# EAGLE design dream_breakout (EAGLE 7.2.0)
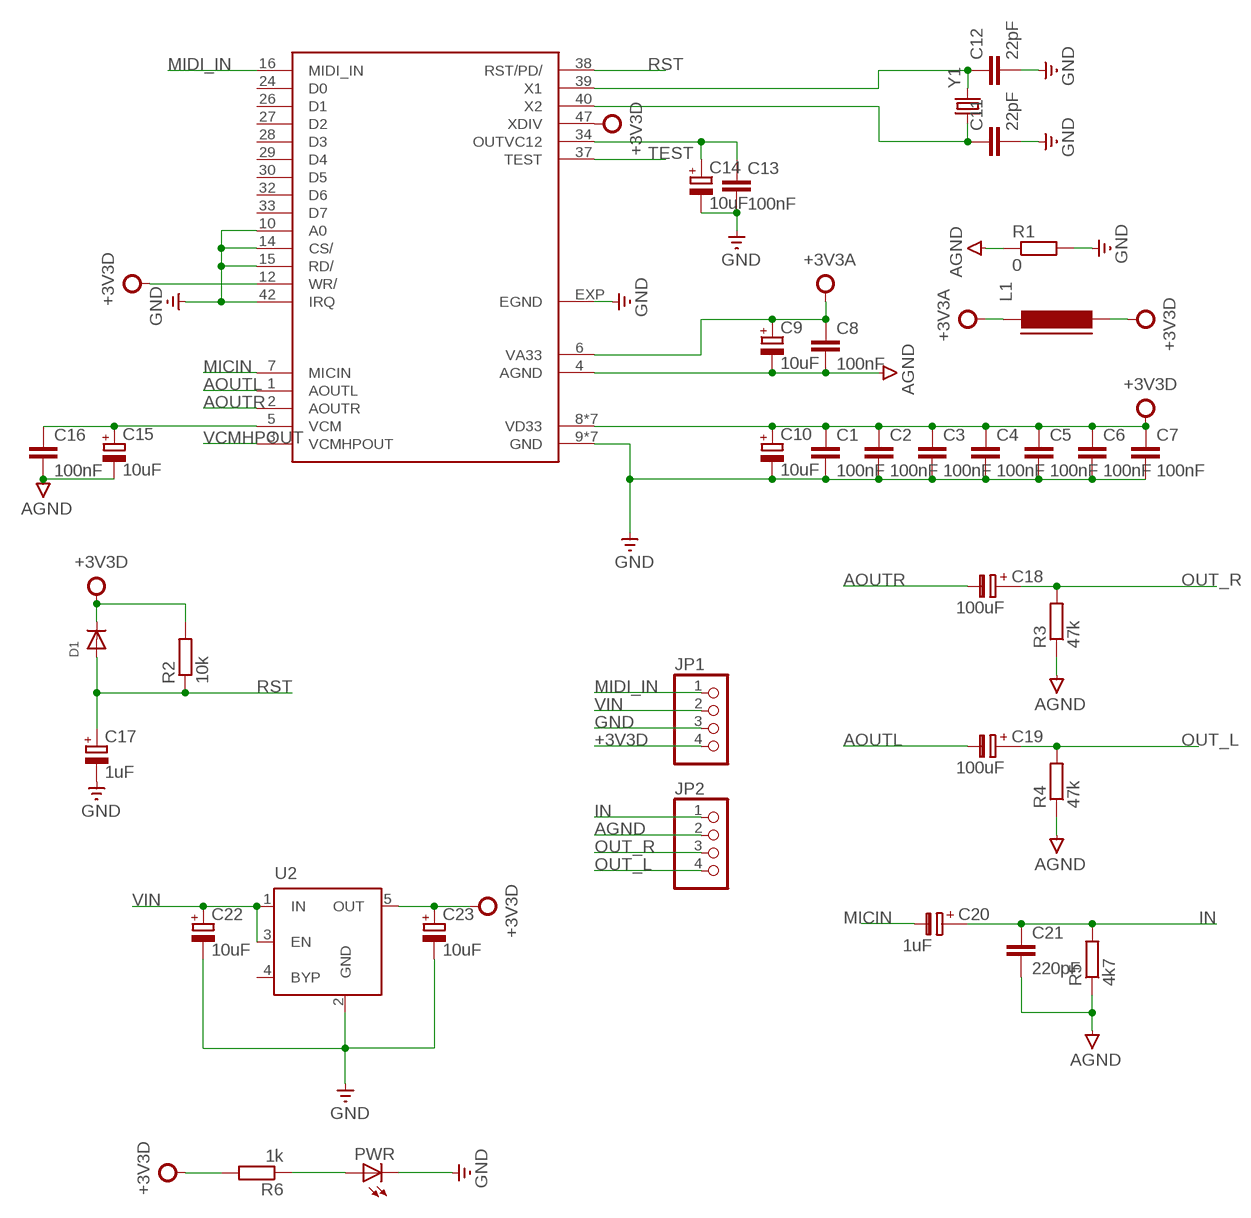
[diagram p0: schematic, sheet 1]

## Parts
C1  100nF  C-EUC0603K  [C0603K]
C2  100nF  C-EUC0603K  [C0603K]
C3  100nF  C-EUC0603K  [C0603K]
C4  100nF  C-EUC0603K  [C0603K]
C5  100nF  C-EUC0603K  [C0603K]
C6  100nF  C-EUC0603K  [C0603K]
C7  100nF  C-EUC0603K  [C0603K]
C8  100nF  C-EUC0603K  [C0603K]
C9  10uF  CPOL-EUA/3216-18R  [A/3216-18R]
C10  10uF  CPOL-EUA/3216-18R  [A/3216-18R]
C11  22pF  C-EUC0603K  [C0603K]
C12  22pF  C-EUC0603K  [C0603K]
C13  100nF  C-EUC0603K  [C0603K]
C14  10uF  CPOL-EUA/3216-18R  [A/3216-18R]
C15  10uF  CPOL-EUA/3216-18R  [A/3216-18R]
C16  100nF  C-EUC0603K  [C0603K]
C17  1uF  CPOL-EUA/3216-18R  [A/3216-18R]
C18  100uF  C-PR-SMD-SV-B  [SV-B]
C19  100uF  C-PR-SMD-SV-B  [SV-B]
C20  1uF  C-PR-SMD-SV-B  [SV-B]
C21  220pF  C-EUC0603K  [C0603K]
C22  10uF  CPOL-EUA/3216-18R  [A/3216-18R]
C23  10uF  CPOL-EUA/3216-18R  [A/3216-18R]
D1  DIODESOD-123  [SOD-123]
JP1  HEADER-1X4ROUND  [1X04_ROUND]
JP2  HEADER-1X4ROUND  [1X04_ROUND]
L1  FERRITE-0603  [FB603]
PWR  LEDCHIP-LED0603  [CHIP-LED0603]
R1  0  R-EU_R0603  [R0603]
R2  10k  R-EU_R0603  [R0603]
R3  47k  R-EU_R0603  [R0603]
R4  47k  R-EU_R0603  [R0603]
R5  4k7  R-EU_R0603  [R0603]
R6  1k  R-EU_R0603  [R0603]
U1  SAM2695  [QFN48]
U2  MIC5219XX  [SOT23-5]
Y1  CRYSTALTXC-7A  [CRYSTAL-TXC-7A]

## Nets
+3V3A [VCC]: C8.1 C9.+ L1.1 U1.6(VA33)
+3V3D [VCC]: C1.1 C2.1 C3.1 C4.1 C5.1 C6.1 C7.1 C10.+ C23.+ D1.C JP1.4 L1.2 R2.2 R6.2 U1.8(VD33) U1.11(VD33) U1.12(WR/) U1.20(VD33) U1.31(VD33) U1.35(VD33) U1.41(VD33) U1.46(VD33) U1.47(XDIV) U2.5(OUT)
AGND [GND]: C8.2 C9.- C15.- C16.2 C21.2 JP2.2 R1.1 R3.1 R4.1 R5.1 U1.4(AGND)
AOUTL: C19.- U1.1(AOUTL)
AOUTR: C18.- U1.2(AOUTR)
GND [GND]: C1.2 C2.2 C3.2 C4.2 C5.2 C6.2 C7.2 C10.- C11.2 C12.2 C13.2 C14.- C17.- C22.- C23.- JP1.3 PWR.C R1.2 U1.9(GND) U1.10(A0) U1.13(GND) U1.14(CS/) U1.15(RD/) U1.18(GND) U1.25(GND) U1.36(GND) U1.42(IRQ) U1.45(GND) U1.48(GND) U1.EXP(EGND) U2.2(GND)
IN: C20.+ C21.1 JP2.1 R5.2
MICIN: C20.- U1.7(MICIN)
MIDI_IN: JP1.1 U1.16(MIDI_IN)
N$2: C13.1 C14.+ U1.34(OUTVC12)
N$3: C12.1 U1.39(X1) Y1.P$2
N$4: C11.1 U1.40(X2) Y1.P$1
N$5: PWR.A R6.1
N$6: C15.+ C16.1 U1.5(VCM)
OUT_L: C19.+ JP2.4 R4.2
OUT_R: C18.+ JP2.3 R3.2
RST: C17.+ D1.A R2.1 U1.38(RST/PD/)
TEST: U1.37(TEST)
VCMHPOUT: U1.3(VCMHPOUT)
VIN [VBUS]: C22.+ JP1.2 U2.1(IN) U2.3(EN)
Unconnected: U1.24(D0) U1.26(D1) U1.27(D2) U1.28(D3) U1.29(D4) U1.30(D5) U1.32(D6) U1.33(D7) U2.4(BYP)

## Library data of the parts
C1-C8 C11-C13 C16 C21 = rcl:C-EU: CAPACITOR, European symbol
C9 C10 C14 C15 C17 C22 C23 = rcl:CPOL-EU: POLARIZED CAPACITOR, European symbol
C18-C20 = cap-pan40:C-PR: POLARIZED ELECTROLYTIC/TANTALUM
D1 = adafruit:DIODE: Diode SMADIODE - SMA Surface Mount Package 20V 1A Schottky Diode Digikey: 641-1014-6-ND DO-1N4148 - Through Hole Small Current Diode SOD-123 20V 1 A (.5mV Vf) Schottky Diode - Digikey: MBRX120TPMSCT-ND SOD-323 10V 570mA (.38mV Vf, 3ns) Schottky Diode - Digikey: ZLLS410CT-ND SOD-523 30V 30mA Schottky Diode (RB751S-40TE61) - Digikey: RB751S-40TE61CT-ND SOT23-R/W - SOT23 Package (R = Solder Paste/Reflow Ovens, W = Hand-Soldering) BAT54Film 40V 300mA - Digikey: 497-7162-1-ND
JP1 JP2 = microbuilder:HEADER-1X4: PIN HEADER
L1 = dp_devices:FERRITE: Ferrite bead in various packages
PWR = led:LED: LED OSRAM: - CHIPLED LG R971, LG N971, LY N971, LG Q971, LY Q971, LO R971, LY R971 LH N974, LH R974 LS Q976, LO Q976, LY Q976 LO Q996 - Hyper CHIPLED LW Q18S LB Q993, LB Q99A, LB R99A - SideLED LS A670, LO A670, LY A670, LG A670, LP A670 LB A673, LV A673, LT A673, LW A673 LH A674 LY A675 LS A676, LA A676, LO A676, LY A676, LW A676 LS A679, LY A679, LG A679 - Hyper Micro SIDELED® LS Y876, LA Y876, LO Y876, LY Y876 LT Y87S - SmartLED LW L88C, LW L88S LB L89C, LB L89S, LG L890 LS L89K, LO L89K, LY L89K LS L896, LA L896, LO L896, LY L896 - TOPLED LS T670, LO T670, LY T670, LG T670, LP T670 LSG T670, LSP T670, LSY T670, LOP T670, LYG T670 LG T671, LOG T671, LSG T671 LB T673, LV T673, LT T673, LW T673 LH T674 LS T676, LA T676, LO T676, LY T676, LB T676, LH T676, LSB T676, LW T676 LB T67C, LV T67C, LT T67C, LS T67K, LO T67K, LY T67K, LW E67C LS E67B, LA E67B, LO E67B, LY E67B, LB E67C, LV E67C, LT E67C LW T67C LS T679, LY T679, LG T679 LS T770, LO T770, LY T770, LG T770, LP T770 LB T773, LV T773, LT T773, LW T773 LH T774 LS E675, LA E675, LY E675, LS T675 LS T776, LA T776, LO T776, LY T776, LB T776 LHGB T686 LT T68C, LB T68C - Hyper Mini TOPLED® LB M676 - Mini TOPLED Santana® LG M470 LS M47K, LO M47K, LY M47K Source: http://www.osram.convergy.de LUXEON: - LUMILED® LXK2-PW12-R00, LXK2-PW12-S00, LXK2-PW14-U00, LXK2-PW14-V00 LXK2-PM12-R00, LXK2-PM12-S00, LXK2-PM14-U00 LXK2-PE12-Q00, LXK2-PE12-R00, LXK2-PE12-S00, LXK2-PE14-T00, LXK2-PE14-U00 LXK2-PB12-K00, LXK2-PB12-L00, LXK2-PB12-M00, LXK2-PB14-N00, LXK2-PB14-P00, LXK2-PB14-Q00 LXK2-PR12-L00, LXK2-PR12-M00, LXK2-PR14-Q00, LXK2-PR14-R00 LXK2-PD12-Q00, LXK2-PD12-R00, LXK2-PD12-S00 LXK2-PH12-R00, LXK2-PH12-S00 LXK2-PL12-P00, LXK2-PL12-Q00, LXK2-PL12-R00 Source: www.luxeon.com KINGBRIGHT: KA-3528ASYC Source: www.kingbright.com
R1-R6 = rcl:R-EU_: RESISTOR, European symbol
U1 = sam2695:SAM2695
U2 = v-reg-micrel:MIC5219XX: VOLTAGE REGULATOR; OC_FARNELL: unknown; OC_NEWARK: unknown
Y1 = SparkFun-FreqCtrl:CRYSTAL: Various standard crystals. Proven footprints. Spark Fun Electronics SKU : COM-00534

## Net classes
1 GND: width 0.305 mm
2 VCC: width 0.305 mm
3 VBUS: width 0.508 mm

## Board
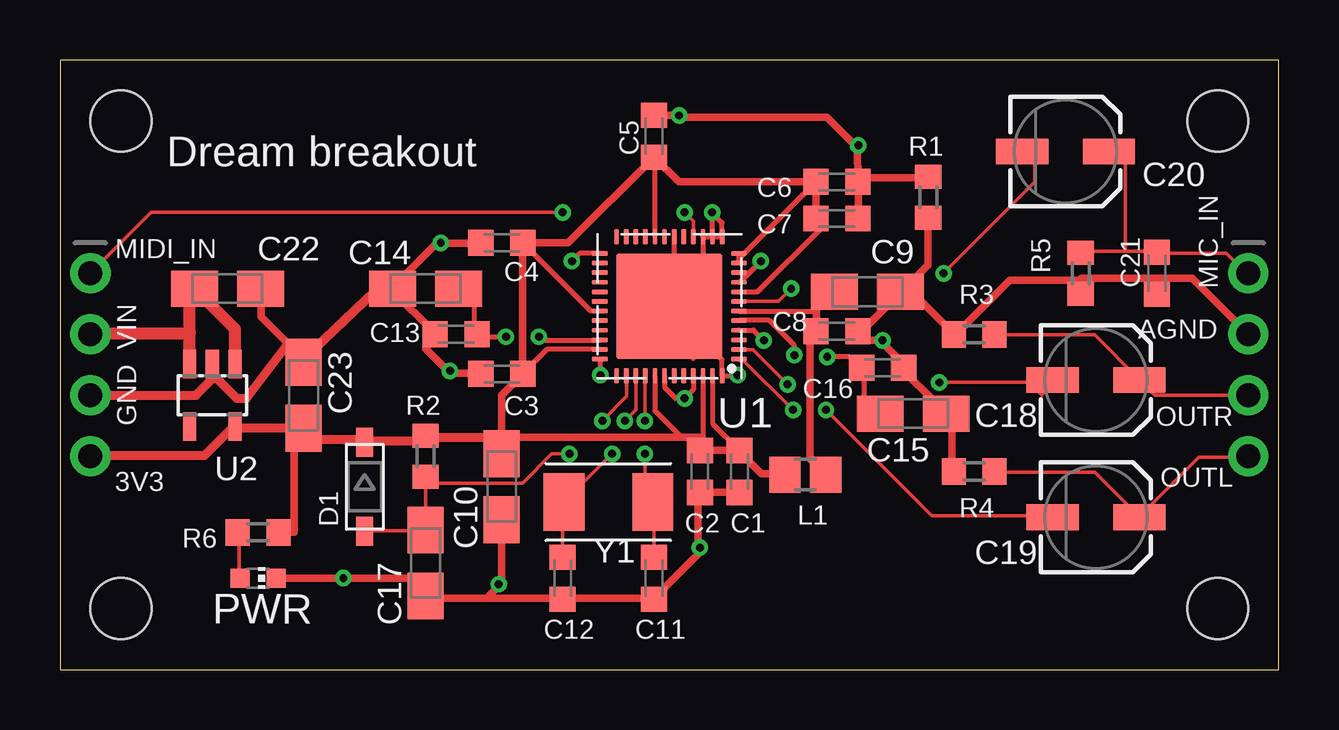
[diagram p1: board, top side]
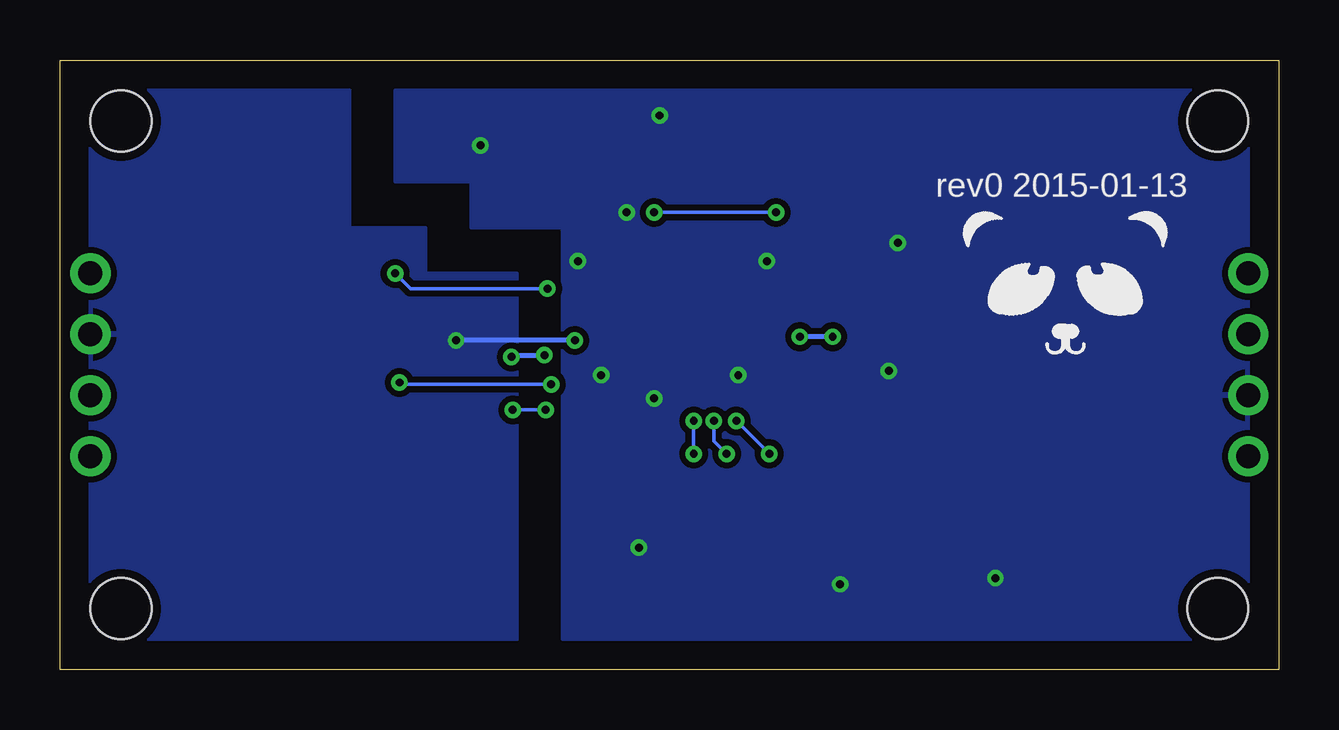
[diagram p2: board, bottom side, seen from below]

Size 50.8 x 25.4 mm. Coordinates in mm from the lower left corner, seen from the top.
Outline: 0,0 50.8,0 50.8,25.4 0,25.4 0,0
Copper layers (1*16): Top 0.0356mm / dielectric 1.5011mm / Bottom 0.0356mm
Design rules "oshpark-2layer": minimum track width 6mil, minimum drill 13mil, track to track 6mil, track to pad 6mil, pad to pad 6mil, via to via 6mil, smd to smd 6mil, copper to edge 15mil, drill to drill 6mil, minimum pad ring 7mil, minimum via ring 7mil, stop-mask expansion 4mil, vias tented up to drill 0mil, thermal gap 10mil
Holes 2.54 mm at 48.26,2.54 48.26,22.86 2.54,22.86 2.54,2.54

### Footprints (pad centres in the part's own frame; a part is rotated, then mirrored left to right if it is on the bottom)
C0603K = smd 1.05 x 1.08: 1 -0.875,0; 2 0.875,0
A/3216-18R = smd 1.95 x 1.5: + 1.375,0; - -1.375,0
SV-B = smd 2.184 x 1.067: + -1.81,0; - 1.81,0
SOD-123 = smd 1.2 x 0.7: A 1.85,0; C -1.85,0
1X04_ROUND = drill 1 pad 1.676: 1 -3.81,0; 2 -1.27,0; 3 1.27,0; 4 3.81,0
FB603 = smd 1.3 x 1.5: 1 -0.85,0; 2 0.85,0
CHIP-LED0603 = smd 0.8 x 0.8: A 0,-0.75; C 0,0.75
R0603 = smd 1 x 1.1: 1 -0.85,0; 2 0.85,0
QFN48 = smd 0.65 x 0.2: 1 -2.9,2.3; 2 -2.9,1.9; 3 -2.9,1.5; 4 -2.9,1.1; 5 -2.9,0.7; 6 -2.9,0.3; 7 -2.9,-0.1; 8 -2.9,-0.5; 9 -2.9,-0.9; 10 -2.9,-1.3; 11 -2.9,-1.7; 12 -2.9,-2.1; 25 2.9,-2.1; 26 2.9,-1.7; 27 2.9,-1.3; 28 2.9,-0.9; 29 2.9,-0.5; 30 2.9,-0.1; 31 2.9,0.3; 32 2.9,0.7; 33 2.9,1.1; 34 2.9,1.5; 35 2.9,1.9; 36 2.9,2.3 | smd 0.2 x 0.65: 13 -2.2,-2.8; 14 -1.8,-2.8; 15 -1.4,-2.8; 16 -1,-2.8; 17 -0.6,-2.8; 18 -0.2,-2.8; 19 0.2,-2.8; 20 0.6,-2.8; 21 1,-2.8; 22 1.4,-2.8; 23 1.8,-2.8; 24 2.2,-2.8; 37 2.2,3; 38 1.8,3; 39 1.4,3; 40 1,3; 41 0.6,3; 42 0.2,3; 43 -0.2,3; 44 -0.6,3; 45 -1,3; 46 -1.4,3; 47 -1.8,3; 48 -2.2,3 | smd 4.4 x 4.4: EXP 0,0.1
SOT23-5 = smd 0.55 x 1.2: 1 -0.95,-1.3; 2 0,-1.3; 3 0.95,-1.3; 4 0.95,1.3; 5 -0.95,1.3
CRYSTAL-TXC-7A = smd 1.7 x 2.4: P$1 1.85,0; P$2 -1.85,0

### Placement (x,y rotation side)
C1  28.32,8.26 270 top
C2  26.67,8.26 270 top
C3  18.41,12.32 180 top
C4  18.41,17.78 180 top
C5  24.77,22.23 90 top
C6  32.38,20.32 0 top
C7  32.38,18.8 0 top
C8  32.38,14.1 0 top
C9  33.66,15.75 180 top
C10  18.41,7.62 90 top
C11  24.77,3.81 270 top
C12  20.95,3.81 270 top
C13  16.51,13.97 180 top
C14  15.24,15.88 0 top
C15  35.56,10.67 180 top
C16  34.29,12.57 0 top
C17  15.24,4.45 90 top
C18  43.18,12.06 180 top
C19  43.18,6.35 180 top
C20  41.91,21.59 180 top
C21  45.72,16.51 270 top
C22  6.99,15.88 180 top
C23  10.16,11.43 270 top
D1  12.7,7.62 270 top
JP1  1.27,12.7 270 top
JP2  49.53,12.7 270 top
L1  31.06,8.13 180 top
PWR  8.26,3.81 270 top
R1  36.2,19.68 90 top
R2  15.24,8.89 90 top
R3  38.1,13.97 0 top
R4  38.1,8.26 0 top
R5  42.55,16.51 90 top
R6  8.26,5.71 0 top
U1  25.4,15.24 180 top
U2  6.35,11.43 180 top
U$1  [PANDA]  8.89,15.24 0 bottom
Y1  22.86,6.99 0 top

### Tracks (layer width: path | path; a pad name or v marks a point on that pad's centre or on a via)
+3V3A
  Top 0.203: U1.6 31.56,14.94 C8.1
  Top 0.305: C9.+ 32.21,15.7 31.52,15.01 31.52,14.1 C8.1 31.6,14.02 31.27,13.72 31.27,8.79 L1.1
+3V3D
  Top 0.203: U1.47 27.2,10.25 C1.1 | U1.46 26.8,9.26 C2.1 | U1.20 24.8,21.32 C5.1 | U1.8 29.07,15.74 31.75,18.41 31.75,18.56 C7.1 | U1.11 28.3,17.11 | 28.3,17.11 C6.1 | 28.3,17.11 U1.12 | U1.35 20.31,13.34 C3.1 | U1.31 22.13,14.94 C4.1 | U1.41 24.8,10.79 25.91,9.68
  Top 0.305: L1.2 30.15,8.15 29.23,8.15 28.4,8.99 C1.1 28.32,9.14 26.87,9.14 C2.1 26.67,9.68 25.91,9.68 18.41,9.68 | 10.59,10.06 9.98,10.06 C23.+ | 7.32,10.06 U2.5 7.16,10.06 | 1.29,8.91 JP1.4 | 10.54,9.6 10.24,9.91 C23.+ | 12.62,9.6 D1.C 12.7,9.53 | C7.1 C6.1 25.8,20.32 C5.1 24.74,21.34 21.18,17.78 C4.1 C3.1 19.21,12.22 18.41,11.43 18.41,9.68 | R6.2 9.75,5.71 9.75,9.6 C23.+ | 15.72,9.68 15.24,9.53 R2.2 | 18.41,9.68 C10.+
  Top 0.381: 9.98,10.06 7.32,10.06 | 1.29,8.91 6.02,8.91 7.16,10.06 | 10.54,9.6 12.62,9.6 | 15.72,9.68 18.41,9.68 | 15.24,9.53 12.7,9.53
AGND  (via drill 0.33)
  Top 0.203: U1.4 28.91,14.14 v29.34,13.72 | 33.13,13.72 C8.2
  Top 0.305: R1.1 36.17,18.82 36.17,16.84 35.1,15.77 C9.- | C8.2 33.43,14.1 34.95,15.62 C9.- | 45.7,16.31 C21.2 45.77,16.31 | C9.- 35.33,15.93 37.24,14.02 R3.1 37.39,14.02 39.6,16.23 42.42,16.23 R5.1 42.57,16.31 45.77,16.31 | 45.77,16.31 47.19,16.31 JP2.2 | 33.13,13.72 v34.29,13.72 34.27,13.64 35.18,12.72 C16.2 35.2,12.42 36.42,11.2 36.42,10.74 C15.- 36.96,10.52 37.19,10.29 37.19,8.31 R4.1
  Bottom 0.203: v29.34,13.72 v34.29,13.72
  pour Bottom (isolate 0.254): 31.75,16.51 31.75,1.27 49.53,1.27 49.53,24.13 38.73,24.13 38.73,18.41 35.56,18.41 35.56,16.51
AOUTL  (via drill 0.33)
  Top 0.152: v30.56,10.82 28.5,12.88 28.35,12.88 U1.1 | v31.93,10.82 36.35,6.4 41.3,6.4 C19.-
  Bottom 0.152: v31.93,10.82 v30.56,10.82
AOUTR  (via drill 0.33)
  Top 0.152: v30.33,11.89 28.88,13.34 28.35,13.34 U1.2 | v36.65,11.96 40.39,11.96 40.92,11.43 C18.-
  Bottom 0.152: v30.33,11.89 36.58,11.89 v36.65,11.96
GND  (via drill 0.33)
  Top 0.203: 26.4,12.97 25.4,13.97 | 25.4,13.97 25.97,14.54 27.6,12.91 U1.48 28.22,12.24 v28.25,12.27 | 25.2,13.77 25.4,13.97 | U1.42 25.2,11.76 25.65,11.3 v26.04,11.3 26.4,11.67 U1.45 | U1.10 28.73,16.54 | 28.73,16.54 v29.21,17.02 | U1.9 28.33,16.14 28.73,16.54 | U1.14 27.18,18.06 v27.18,19.05 27.6,18.63 U1.13 U1.15 26.8,16.64 25.6,15.44 | U1.25 21.66,17.34 v21.34,17.02 | U1.36 22.5,12.3 v22.53,12.27 | U1.18 25.6,15.44 | 25.6,15.44 25.4,15.24
  Top 0.305: C2.2 26.72,7.39 C1.2 | 26.57,7.32 C2.2 | 25.97,14.54 25.43,15.09 U1.EXP | C7.2 33.27,18.82 33.27,20.27 C6.2 | R1.2 36.17,20.5 33.43,20.5 33.35,20.42 C6.2 | C5.2 24.82,23.09 v25.81,23.09 25.88,23.01 31.98,23.01 33.25,21.74 C6.2 | 6.33,12.09 6.33,12.72 U2.2 6.4,12.27 | C3.2 17.5,12.34 16.26,12.34 15.24,13.36 C13.2 15.54,14.1 13.87,15.77 C14.- | C22.- 8.38,15.85 8.38,14.71 10.13,12.95 C23.- | 9.45,13.49 C23.- | PWR.C v11.81,3.81 14.55,3.81 15.16,3.2 C17.- 15.34,2.97 17.78,2.97 | C4.2 17.53,17.75 15.7,17.75 13.87,15.93 C14.- | 13.11,15.77 13.72,15.77 C14.- | 10.16,12.95 C23.- | 20.95,2.97 24.77,2.97 C11.2 24.84,3.05 26.59,4.8 26.59,7.16 C2.2 | 20.95,2.97 C12.2 | 20.95,2.97 17.78,2.97 | C10.- 18.41,3.61 17.78,2.97
  Top 0.381: 6.33,12.09 5.66,11.43 JP1.3 | 9.45,13.49 7.77,11.3 7.37,11.3 6.4,12.27 | 10.16,12.95 13.11,15.77
  other vias: 33.27,21.84 15.88,17.78 16.26,12.45 26.67,5.08 18.29,3.56
  pour Bottom (isolate 0.254): 36.83,20.32 36.83,24.13 1.27,24.13 1.27,1.27 29.84,1.27 29.84,18.41 33.66,18.41 33.66,20.32
IN
  Top 0.152: 44.4,17.42 42.57,17.42 R5.2 | 44.4,17.42 45.7,17.42 C21.1 45.77,17.35 48.62,17.35 49.43,16.54 49.51,16.54 JP2.1 | 44.4,17.42 44.4,21.57 C20.+
MICIN  (via drill 0.33)
  Top 0.152: U1.7 29.95,15.34 v30.48,15.88 | v36.83,16.51 40.64,20.32 40.64,21.5 C20.-
  Bottom 0.152: v30.48,15.88 36.2,15.88 v36.83,16.51
MIDI_IN  (via drill 0.33)
  Top 0.152: U1.16 26.4,18.68 v26.04,19.05 | v20.95,19.05 3.81,19.05 JP1.1
  Bottom 0.152: v26.04,19.05 v20.95,19.05
N$2  (via drill 0.33)
  Top 0.152: 17.27,14.1 17.35,14.02 C13.1 17.45,13.95 17.53,13.87 | 17.27,15.85 C14.+ | 22.48,13.72 U1.34
  Top 0.203: 17.27,14.1 17.27,15.85 | 22.48,13.72 20.12,13.72 v19.96,13.87 | 17.53,13.87 v18.59,13.87
  Bottom 0.203: v18.59,13.87 v19.96,13.87
N$3  (via drill 0.33)
  Top 0.152: C12.1 20.95,6.93 Y1.P$2 21.03,7.01 v23.01,8.99 | v23.55,10.36 24,10.82 24,12.19 U1.39
  Bottom 0.152: v23.55,10.36 23.55,9.53 v23.01,8.99
N$4  (via drill 0.33)
  Top 0.152: C11.1 24.77,6.93 Y1.P$1 24.69,7.01 24.38,7.32 v24.38,8.99 | v24.38,10.36 24.38,12.19 U1.40
  Bottom 0.152: v24.38,8.99 v24.38,10.36
N$5
  Top 0.152: PWR.A 7.47,3.81 7.47,5.71 R6.1
N$6  (via drill 0.33)
  Top 0.152: 33.5,12.5 33.43,12.57 C16.1 33.35,12.57 32.89,13.03 | 33.5,10.67 C15.+ | 28.32,14.55 U1.5
  Top 0.203: 33.5,12.5 33.5,10.67 | 28.32,14.55 29.57,14.55 30.61,13.51 v30.61,13.11 | 32.89,13.03 v31.98,13.03
  Bottom 0.152: v31.98,13.03 31.9,13.11
  Bottom 0.203: 31.9,13.11 v30.61,13.11
OUT_L
  Top 0.152: R4.2 39.01,8.23 43.13,8.23 44.96,6.4 C19.+ 45.03,6.4 47.47,8.84 49.53,8.84 JP2.4
OUT_R
  Top 0.152: R3.2 39.01,13.95 43.13,13.95 44.96,12.12 C18.+ 45.03,12.04 45.64,11.43 JP2.3
RST  (via drill 0.33)
  Top 0.152: D1.A 12.72,5.79 15.24,5.79 C17.+ 15.24,7.77 | v22.61,10.36 23.62,11.38 23.62,12.19 U1.38 | v21.23,8.99 20.5,8.99 19.28,7.77 15.24,7.77 | 15.24,7.77 R2.1
  Bottom 0.152: v21.23,8.99 v22.61,10.36
VIN
  Top 0.406: 1.29,14.02 JP1.2
  Top 0.508: 1.29,14.02 5.41,14.02 5.4,14.01 | 5.4,14.01 5.4,15.66 C22.+ 7.3,14.19 U2.1 | U2.3 5.4,14.01

### Text on the board
tNames: Dream breakout | MIDI_IN | MIC_IN | AGND | VIN | GND | OUTR | 3V3 | OUTL
bNames: rev0 2015-01-13